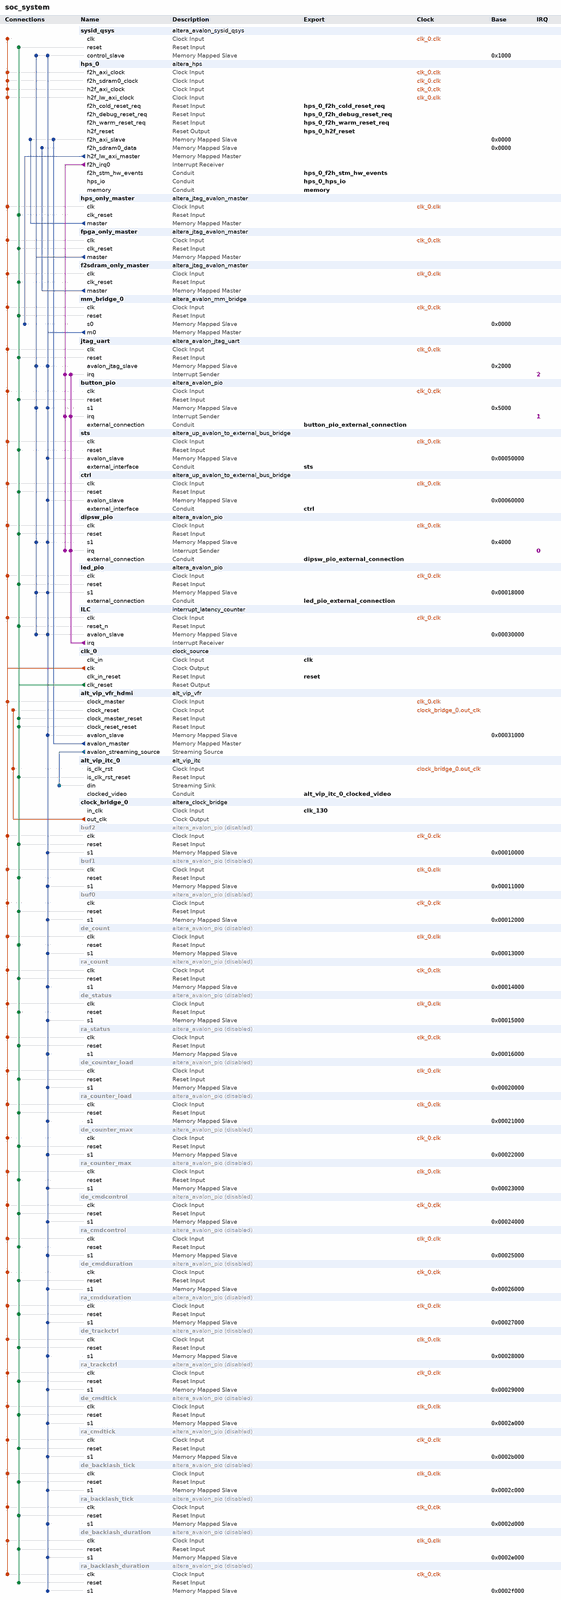
[diagram p0: system contents, whole]
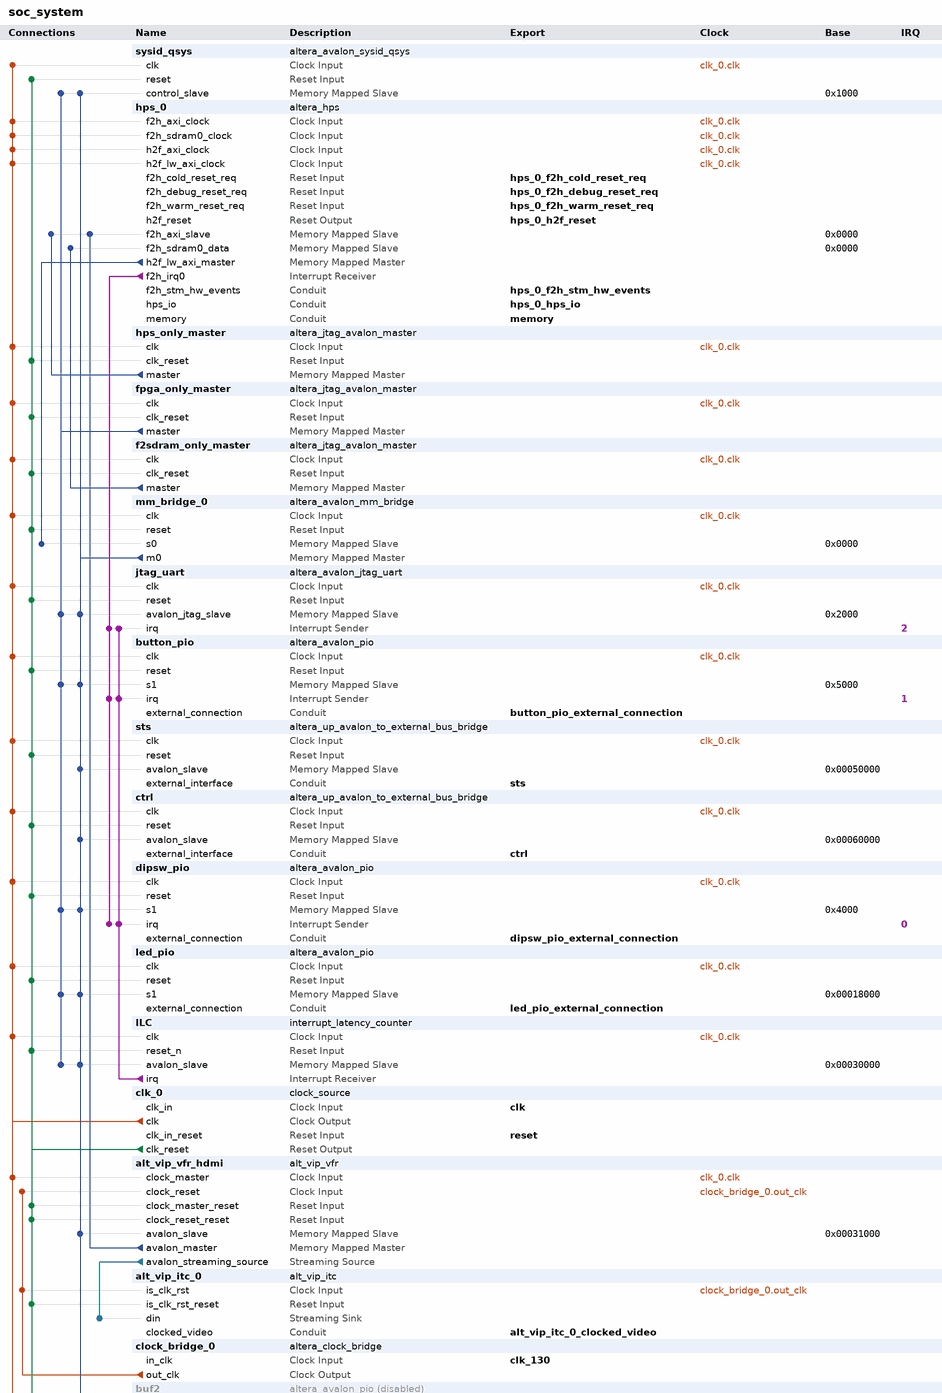
[diagram p1: system contents, upper part]
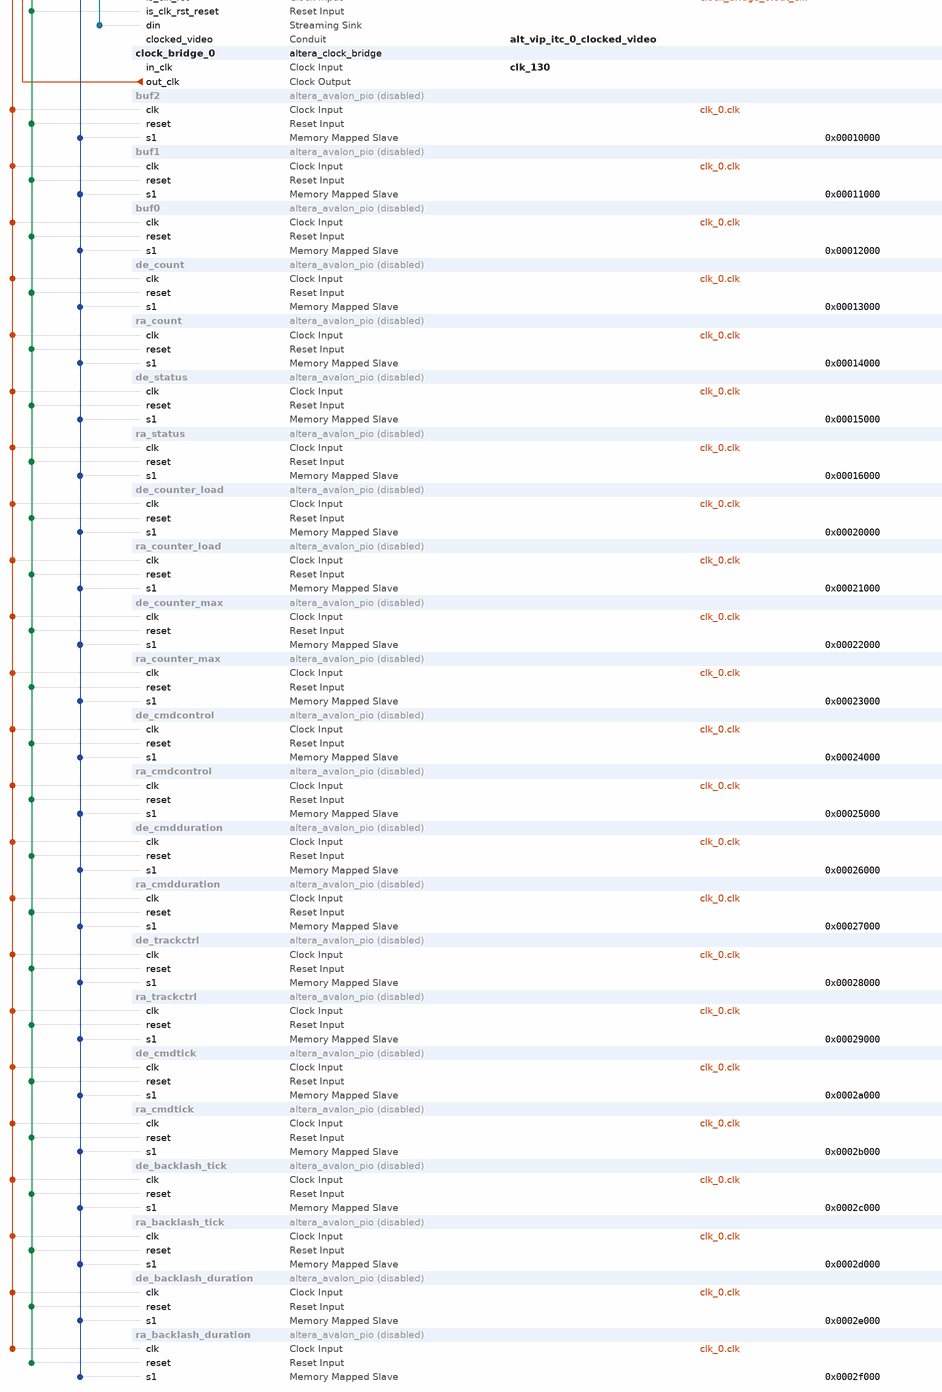
[diagram p2: system contents, lower part]
# Platform Designer (Qsys) system soc_system, Cyclone V 5CSEBA6U23I7DK
# Parameters at their usual value, and those the tool derives, are not listed.
package require -exact qsys 18.1
create_system soc_system
set_project_property DEVICE_FAMILY {Cyclone V}
set_project_property DEVICE 5CSEBA6U23I7DK

add_instance sysid_qsys altera_avalon_sysid_qsys 18.1
set_instance_parameter_value sysid_qsys id -1395322110

add_instance hps_0 altera_hps 18.1
set_instance_parameter_value hps_0 EMAC1_Mode RGMII
set_instance_parameter_value hps_0 EMAC1_PinMuxing {HPS I/O Set 0}
set_instance_parameter_value hps_0 F2SCLK_COLDRST_Enable true
set_instance_parameter_value hps_0 F2SCLK_DBGRST_Enable true
set_instance_parameter_value hps_0 F2SCLK_WARMRST_Enable true
set_instance_parameter_value hps_0 F2SDRAM_Type {Avalon-MM Bidirectional}
set_instance_parameter_value hps_0 F2SDRAM_Width 256
set_instance_parameter_value hps_0 F2SINTERRUPT_Enable true
set_instance_parameter_value hps_0 F2S_Width 3
set_instance_parameter_value hps_0 FPGA_PERIPHERAL_OUTPUT_CLOCK_FREQ_EMAC0_GTX_CLK 100
set_instance_parameter_value hps_0 FPGA_PERIPHERAL_OUTPUT_CLOCK_FREQ_EMAC0_MD_CLK 100.0
set_instance_parameter_value hps_0 FPGA_PERIPHERAL_OUTPUT_CLOCK_FREQ_EMAC1_GTX_CLK 100
set_instance_parameter_value hps_0 FPGA_PERIPHERAL_OUTPUT_CLOCK_FREQ_EMAC1_MD_CLK 100.0
set_instance_parameter_value hps_0 HPS_PROTOCOL DDR3
set_instance_parameter_value hps_0 I2C0_Mode I2C
set_instance_parameter_value hps_0 I2C0_PinMuxing {HPS I/O Set 0}
set_instance_parameter_value hps_0 I2C1_Mode I2C
set_instance_parameter_value hps_0 I2C1_PinMuxing {HPS I/O Set 0}
set_instance_parameter_value hps_0 LWH2F_Enable true
set_instance_parameter_value hps_0 MEM_BANKADDR_WIDTH 3
set_instance_parameter_value hps_0 MEM_CLK_FREQ 400.0
set_instance_parameter_value hps_0 MEM_COL_ADDR_WIDTH 10
set_instance_parameter_value hps_0 MEM_DQ_WIDTH 32
set_instance_parameter_value hps_0 MEM_DRV_STR RZQ/6
set_instance_parameter_value hps_0 MEM_ROW_ADDR_WIDTH 15
set_instance_parameter_value hps_0 MEM_RTT_NOM RZQ/6
set_instance_parameter_value hps_0 MEM_RTT_WR {Dynamic ODT off}
set_instance_parameter_value hps_0 MEM_TCL 7
set_instance_parameter_value hps_0 MEM_TFAW_NS 37.5
set_instance_parameter_value hps_0 MEM_TRAS_NS 35.0
set_instance_parameter_value hps_0 MEM_TRCD_NS 13.75
set_instance_parameter_value hps_0 MEM_TRFC_NS 300.0
set_instance_parameter_value hps_0 MEM_TRP_NS 13.75
set_instance_parameter_value hps_0 MEM_VENDOR Other
set_instance_parameter_value hps_0 MEM_WTCL 7
set_instance_parameter_value hps_0 QSPI_Mode N/A
set_instance_parameter_value hps_0 QSPI_PinMuxing Unused
set_instance_parameter_value hps_0 REF_CLK_FREQ 25.0
set_instance_parameter_value hps_0 S2FCLK_USER2CLK 4
set_instance_parameter_value hps_0 S2F_Width 2
set_instance_parameter_value hps_0 SDIO_Mode {4-bit Data}
set_instance_parameter_value hps_0 SDIO_PinMuxing {HPS I/O Set 0}
set_instance_parameter_value hps_0 SPIM1_Mode {Single Slave Select}
set_instance_parameter_value hps_0 SPIM1_PinMuxing {HPS I/O Set 0}
set_instance_parameter_value hps_0 STM_Enable true
set_instance_parameter_value hps_0 TIMING_BOARD_AC_SKEW 0.02
set_instance_parameter_value hps_0 TIMING_BOARD_AC_TO_CK_SKEW 0.0
set_instance_parameter_value hps_0 TIMING_BOARD_DQ_TO_DQS_SKEW 0.0
set_instance_parameter_value hps_0 TIMING_BOARD_MAX_CK_DELAY 0.6
set_instance_parameter_value hps_0 TIMING_BOARD_MAX_DQS_DELAY 0.6
set_instance_parameter_value hps_0 TIMING_BOARD_SKEW_BETWEEN_DQS 0.02
set_instance_parameter_value hps_0 TIMING_BOARD_SKEW_CKDQS_DIMM_MAX 0.01
set_instance_parameter_value hps_0 TIMING_BOARD_SKEW_CKDQS_DIMM_MIN -0.01
set_instance_parameter_value hps_0 TIMING_BOARD_SKEW_WITHIN_DQS 0.02
set_instance_parameter_value hps_0 TIMING_TDH 125
set_instance_parameter_value hps_0 TIMING_TDQSCK 400
set_instance_parameter_value hps_0 TIMING_TDQSQ 120
set_instance_parameter_value hps_0 TIMING_TDS 50
set_instance_parameter_value hps_0 TIMING_TIH 250
set_instance_parameter_value hps_0 TIMING_TIS 175
set_instance_parameter_value hps_0 TIMING_TQSH 0.38
set_instance_parameter_value hps_0 UART0_Mode {No Flow Control}
set_instance_parameter_value hps_0 UART0_PinMuxing {HPS I/O Set 0}
set_instance_parameter_value hps_0 USB1_Mode SDR
set_instance_parameter_value hps_0 USB1_PinMuxing {HPS I/O Set 0}
set_instance_parameter_value hps_0 desired_cfg_clk_mhz 100.0
set_instance_parameter_value hps_0 desired_qspi_clk_mhz 370.0

add_instance hps_only_master altera_jtag_avalon_master 18.1

add_instance fpga_only_master altera_jtag_avalon_master 18.1

add_instance f2sdram_only_master altera_jtag_avalon_master 18.1

add_instance mm_bridge_0 altera_avalon_mm_bridge 18.1
set_instance_parameter_value mm_bridge_0 ADDRESS_UNITS SYMBOLS
set_instance_parameter_value mm_bridge_0 ADDRESS_WIDTH 10
set_instance_parameter_value mm_bridge_0 DATA_WIDTH 32
set_instance_parameter_value mm_bridge_0 MAX_PENDING_RESPONSES 4
set_instance_parameter_value mm_bridge_0 USE_AUTO_ADDRESS_WIDTH 1

add_instance jtag_uart altera_avalon_jtag_uart 18.1
set_instance_parameter_value jtag_uart allowMultipleConnections true
set_instance_parameter_value jtag_uart simInteractiveOptions INTERACTIVE_ASCII_OUTPUT

add_instance button_pio altera_avalon_pio 18.1
set_instance_parameter_value button_pio bitClearingEdgeCapReg true
set_instance_parameter_value button_pio captureEdge true
set_instance_parameter_value button_pio direction Input
set_instance_parameter_value button_pio edgeType FALLING
set_instance_parameter_value button_pio generateIRQ true
set_instance_parameter_value button_pio irqType EDGE
set_instance_parameter_value button_pio width 2

add_instance sts altera_up_avalon_to_external_bus_bridge 18.0
set_instance_parameter_value sts addr_size 1
set_instance_parameter_value sts addr_size_multiplier Kbytes
set_instance_parameter_value sts data_size 32

add_instance ctrl altera_up_avalon_to_external_bus_bridge 18.0
set_instance_parameter_value ctrl addr_size 1
set_instance_parameter_value ctrl addr_size_multiplier Kbytes
set_instance_parameter_value ctrl data_size 32

add_instance dipsw_pio altera_avalon_pio 18.1
set_instance_parameter_value dipsw_pio bitClearingEdgeCapReg true
set_instance_parameter_value dipsw_pio captureEdge true
set_instance_parameter_value dipsw_pio direction Input
set_instance_parameter_value dipsw_pio edgeType ANY
set_instance_parameter_value dipsw_pio generateIRQ true
set_instance_parameter_value dipsw_pio irqType EDGE
set_instance_parameter_value dipsw_pio width 4

add_instance led_pio altera_avalon_pio 18.1
set_instance_parameter_value led_pio direction Output
set_instance_parameter_value led_pio resetValue 127
set_instance_parameter_value led_pio width 7

add_instance ILC interrupt_latency_counter 18.1

add_instance clk_0 clock_source 18.1
set_instance_parameter_value clk_0 clockFrequency 50000000

add_instance alt_vip_vfr_hdmi alt_vip_vfr 14.0
set_instance_parameter_value alt_vip_vfr_hdmi MAX_IMAGE_WIDTH 1024

add_instance alt_vip_itc_0 alt_vip_itc 14.0
set_instance_parameter_value alt_vip_itc_0 FIFO_DEPTH 1920
set_instance_parameter_value alt_vip_itc_0 H_ACTIVE_PIXELS 1024
set_instance_parameter_value alt_vip_itc_0 H_BACK_PORCH 160
set_instance_parameter_value alt_vip_itc_0 H_FRONT_PORCH 24
set_instance_parameter_value alt_vip_itc_0 H_SYNC_LENGTH 136
set_instance_parameter_value alt_vip_itc_0 NUMBER_OF_COLOUR_PLANES 4
set_instance_parameter_value alt_vip_itc_0 THRESHOLD 1919
set_instance_parameter_value alt_vip_itc_0 V_ACTIVE_LINES 768
set_instance_parameter_value alt_vip_itc_0 V_BACK_PORCH 29
set_instance_parameter_value alt_vip_itc_0 V_FRONT_PORCH 3
set_instance_parameter_value alt_vip_itc_0 V_SYNC_LENGTH 6

add_instance clock_bridge_0 altera_clock_bridge 18.1
set_instance_parameter_value clock_bridge_0 DERIVED_CLOCK_RATE 0
set_instance_parameter_value clock_bridge_0 EXPLICIT_CLOCK_RATE 0

add_instance buf2 altera_avalon_pio 18.1
set_instance_property buf2 ENABLED false
set_instance_parameter_value buf2 bitClearingEdgeCapReg true
set_instance_parameter_value buf2 captureEdge true
set_instance_parameter_value buf2 direction Input
set_instance_parameter_value buf2 edgeType FALLING
set_instance_parameter_value buf2 generateIRQ true
set_instance_parameter_value buf2 irqType EDGE
set_instance_parameter_value buf2 width 32

add_instance buf1 altera_avalon_pio 18.1
set_instance_property buf1 ENABLED false
set_instance_parameter_value buf1 bitClearingEdgeCapReg true
set_instance_parameter_value buf1 captureEdge true
set_instance_parameter_value buf1 direction Input
set_instance_parameter_value buf1 edgeType FALLING
set_instance_parameter_value buf1 generateIRQ true
set_instance_parameter_value buf1 irqType EDGE
set_instance_parameter_value buf1 width 32

add_instance buf0 altera_avalon_pio 18.1
set_instance_property buf0 ENABLED false
set_instance_parameter_value buf0 bitClearingEdgeCapReg true
set_instance_parameter_value buf0 captureEdge true
set_instance_parameter_value buf0 direction Input
set_instance_parameter_value buf0 edgeType FALLING
set_instance_parameter_value buf0 generateIRQ true
set_instance_parameter_value buf0 irqType EDGE
set_instance_parameter_value buf0 width 32

add_instance de_count altera_avalon_pio 18.1
set_instance_property de_count ENABLED false
set_instance_parameter_value de_count bitClearingEdgeCapReg true
set_instance_parameter_value de_count captureEdge true
set_instance_parameter_value de_count direction Input
set_instance_parameter_value de_count edgeType FALLING
set_instance_parameter_value de_count generateIRQ true
set_instance_parameter_value de_count irqType EDGE
set_instance_parameter_value de_count width 32

add_instance ra_count altera_avalon_pio 18.1
set_instance_property ra_count ENABLED false
set_instance_parameter_value ra_count bitClearingEdgeCapReg true
set_instance_parameter_value ra_count captureEdge true
set_instance_parameter_value ra_count direction Input
set_instance_parameter_value ra_count edgeType FALLING
set_instance_parameter_value ra_count generateIRQ true
set_instance_parameter_value ra_count irqType EDGE
set_instance_parameter_value ra_count width 32

add_instance de_status altera_avalon_pio 18.1
set_instance_property de_status ENABLED false
set_instance_parameter_value de_status bitClearingEdgeCapReg true
set_instance_parameter_value de_status captureEdge true
set_instance_parameter_value de_status direction Input
set_instance_parameter_value de_status edgeType FALLING
set_instance_parameter_value de_status generateIRQ true
set_instance_parameter_value de_status irqType EDGE
set_instance_parameter_value de_status width 32

add_instance ra_status altera_avalon_pio 18.1
set_instance_property ra_status ENABLED false
set_instance_parameter_value ra_status bitClearingEdgeCapReg true
set_instance_parameter_value ra_status captureEdge true
set_instance_parameter_value ra_status direction Input
set_instance_parameter_value ra_status edgeType FALLING
set_instance_parameter_value ra_status generateIRQ true
set_instance_parameter_value ra_status irqType EDGE
set_instance_parameter_value ra_status width 32

add_instance de_counter_load altera_avalon_pio 18.1
set_instance_property de_counter_load ENABLED false
set_instance_parameter_value de_counter_load bitClearingEdgeCapReg true
set_instance_parameter_value de_counter_load captureEdge true
set_instance_parameter_value de_counter_load direction Output
set_instance_parameter_value de_counter_load edgeType FALLING
set_instance_parameter_value de_counter_load generateIRQ true
set_instance_parameter_value de_counter_load irqType EDGE
set_instance_parameter_value de_counter_load width 32

add_instance ra_counter_load altera_avalon_pio 18.1
set_instance_property ra_counter_load ENABLED false
set_instance_parameter_value ra_counter_load bitClearingEdgeCapReg true
set_instance_parameter_value ra_counter_load captureEdge true
set_instance_parameter_value ra_counter_load direction Output
set_instance_parameter_value ra_counter_load edgeType FALLING
set_instance_parameter_value ra_counter_load generateIRQ true
set_instance_parameter_value ra_counter_load irqType EDGE
set_instance_parameter_value ra_counter_load width 32

add_instance de_counter_max altera_avalon_pio 18.1
set_instance_property de_counter_max ENABLED false
set_instance_parameter_value de_counter_max bitClearingEdgeCapReg true
set_instance_parameter_value de_counter_max captureEdge true
set_instance_parameter_value de_counter_max direction Output
set_instance_parameter_value de_counter_max edgeType FALLING
set_instance_parameter_value de_counter_max generateIRQ true
set_instance_parameter_value de_counter_max irqType EDGE
set_instance_parameter_value de_counter_max width 32

add_instance ra_counter_max altera_avalon_pio 18.1
set_instance_property ra_counter_max ENABLED false
set_instance_parameter_value ra_counter_max bitClearingEdgeCapReg true
set_instance_parameter_value ra_counter_max captureEdge true
set_instance_parameter_value ra_counter_max direction Output
set_instance_parameter_value ra_counter_max edgeType FALLING
set_instance_parameter_value ra_counter_max generateIRQ true
set_instance_parameter_value ra_counter_max irqType EDGE
set_instance_parameter_value ra_counter_max width 32

add_instance de_cmdcontrol altera_avalon_pio 18.1
set_instance_property de_cmdcontrol ENABLED false
set_instance_parameter_value de_cmdcontrol bitClearingEdgeCapReg true
set_instance_parameter_value de_cmdcontrol captureEdge true
set_instance_parameter_value de_cmdcontrol direction Output
set_instance_parameter_value de_cmdcontrol edgeType FALLING
set_instance_parameter_value de_cmdcontrol generateIRQ true
set_instance_parameter_value de_cmdcontrol irqType EDGE
set_instance_parameter_value de_cmdcontrol width 32

add_instance ra_cmdcontrol altera_avalon_pio 18.1
set_instance_property ra_cmdcontrol ENABLED false
set_instance_parameter_value ra_cmdcontrol bitClearingEdgeCapReg true
set_instance_parameter_value ra_cmdcontrol captureEdge true
set_instance_parameter_value ra_cmdcontrol direction Output
set_instance_parameter_value ra_cmdcontrol edgeType FALLING
set_instance_parameter_value ra_cmdcontrol generateIRQ true
set_instance_parameter_value ra_cmdcontrol irqType EDGE
set_instance_parameter_value ra_cmdcontrol width 32

add_instance de_cmdduration altera_avalon_pio 18.1
set_instance_property de_cmdduration ENABLED false
set_instance_parameter_value de_cmdduration bitClearingEdgeCapReg true
set_instance_parameter_value de_cmdduration captureEdge true
set_instance_parameter_value de_cmdduration direction Output
set_instance_parameter_value de_cmdduration edgeType FALLING
set_instance_parameter_value de_cmdduration generateIRQ true
set_instance_parameter_value de_cmdduration irqType EDGE
set_instance_parameter_value de_cmdduration width 32

add_instance ra_cmdduration altera_avalon_pio 18.1
set_instance_property ra_cmdduration ENABLED false
set_instance_parameter_value ra_cmdduration bitClearingEdgeCapReg true
set_instance_parameter_value ra_cmdduration captureEdge true
set_instance_parameter_value ra_cmdduration direction Output
set_instance_parameter_value ra_cmdduration edgeType FALLING
set_instance_parameter_value ra_cmdduration generateIRQ true
set_instance_parameter_value ra_cmdduration irqType EDGE
set_instance_parameter_value ra_cmdduration width 32

add_instance de_trackctrl altera_avalon_pio 18.1
set_instance_property de_trackctrl ENABLED false
set_instance_parameter_value de_trackctrl bitClearingEdgeCapReg true
set_instance_parameter_value de_trackctrl captureEdge true
set_instance_parameter_value de_trackctrl direction Output
set_instance_parameter_value de_trackctrl edgeType FALLING
set_instance_parameter_value de_trackctrl generateIRQ true
set_instance_parameter_value de_trackctrl irqType EDGE
set_instance_parameter_value de_trackctrl width 32

add_instance ra_trackctrl altera_avalon_pio 18.1
set_instance_property ra_trackctrl ENABLED false
set_instance_parameter_value ra_trackctrl bitClearingEdgeCapReg true
set_instance_parameter_value ra_trackctrl captureEdge true
set_instance_parameter_value ra_trackctrl direction Output
set_instance_parameter_value ra_trackctrl edgeType FALLING
set_instance_parameter_value ra_trackctrl generateIRQ true
set_instance_parameter_value ra_trackctrl irqType EDGE
set_instance_parameter_value ra_trackctrl width 32

add_instance de_cmdtick altera_avalon_pio 18.1
set_instance_property de_cmdtick ENABLED false
set_instance_parameter_value de_cmdtick bitClearingEdgeCapReg true
set_instance_parameter_value de_cmdtick captureEdge true
set_instance_parameter_value de_cmdtick direction Output
set_instance_parameter_value de_cmdtick edgeType FALLING
set_instance_parameter_value de_cmdtick generateIRQ true
set_instance_parameter_value de_cmdtick irqType EDGE
set_instance_parameter_value de_cmdtick width 32

add_instance ra_cmdtick altera_avalon_pio 18.1
set_instance_property ra_cmdtick ENABLED false
set_instance_parameter_value ra_cmdtick bitClearingEdgeCapReg true
set_instance_parameter_value ra_cmdtick captureEdge true
set_instance_parameter_value ra_cmdtick direction Output
set_instance_parameter_value ra_cmdtick edgeType FALLING
set_instance_parameter_value ra_cmdtick generateIRQ true
set_instance_parameter_value ra_cmdtick irqType EDGE
set_instance_parameter_value ra_cmdtick width 32

add_instance de_backlash_tick altera_avalon_pio 18.1
set_instance_property de_backlash_tick ENABLED false
set_instance_parameter_value de_backlash_tick bitClearingEdgeCapReg true
set_instance_parameter_value de_backlash_tick captureEdge true
set_instance_parameter_value de_backlash_tick direction Output
set_instance_parameter_value de_backlash_tick edgeType FALLING
set_instance_parameter_value de_backlash_tick generateIRQ true
set_instance_parameter_value de_backlash_tick irqType EDGE
set_instance_parameter_value de_backlash_tick width 32

add_instance ra_backlash_tick altera_avalon_pio 18.1
set_instance_property ra_backlash_tick ENABLED false
set_instance_parameter_value ra_backlash_tick bitClearingEdgeCapReg true
set_instance_parameter_value ra_backlash_tick captureEdge true
set_instance_parameter_value ra_backlash_tick direction Output
set_instance_parameter_value ra_backlash_tick edgeType FALLING
set_instance_parameter_value ra_backlash_tick generateIRQ true
set_instance_parameter_value ra_backlash_tick irqType EDGE
set_instance_parameter_value ra_backlash_tick width 32

add_instance de_backlash_duration altera_avalon_pio 18.1
set_instance_property de_backlash_duration ENABLED false
set_instance_parameter_value de_backlash_duration bitClearingEdgeCapReg true
set_instance_parameter_value de_backlash_duration captureEdge true
set_instance_parameter_value de_backlash_duration direction Output
set_instance_parameter_value de_backlash_duration edgeType FALLING
set_instance_parameter_value de_backlash_duration generateIRQ true
set_instance_parameter_value de_backlash_duration irqType EDGE
set_instance_parameter_value de_backlash_duration width 32

add_instance ra_backlash_duration altera_avalon_pio 18.1
set_instance_property ra_backlash_duration ENABLED false
set_instance_parameter_value ra_backlash_duration bitClearingEdgeCapReg true
set_instance_parameter_value ra_backlash_duration captureEdge true
set_instance_parameter_value ra_backlash_duration direction Output
set_instance_parameter_value ra_backlash_duration edgeType FALLING
set_instance_parameter_value ra_backlash_duration generateIRQ true
set_instance_parameter_value ra_backlash_duration irqType EDGE
set_instance_parameter_value ra_backlash_duration width 32

# connections
add_connection clk_0.clk alt_vip_vfr_hdmi.clock_master clock
add_connection clk_0.clk buf0.clk clock
add_connection clk_0.clk buf1.clk clock
add_connection clk_0.clk buf2.clk clock
add_connection clk_0.clk button_pio.clk clock
add_connection clk_0.clk ctrl.clk clock
add_connection clk_0.clk de_backlash_duration.clk clock
add_connection clk_0.clk de_backlash_tick.clk clock
add_connection clk_0.clk de_cmdcontrol.clk clock
add_connection clk_0.clk de_cmdduration.clk clock
add_connection clk_0.clk de_cmdtick.clk clock
add_connection clk_0.clk de_count.clk clock
add_connection clk_0.clk de_counter_load.clk clock
add_connection clk_0.clk de_counter_max.clk clock
add_connection clk_0.clk de_status.clk clock
add_connection clk_0.clk de_trackctrl.clk clock
add_connection clk_0.clk dipsw_pio.clk clock
add_connection clk_0.clk f2sdram_only_master.clk clock
add_connection clk_0.clk fpga_only_master.clk clock
add_connection clk_0.clk hps_0.f2h_axi_clock clock
add_connection clk_0.clk hps_0.f2h_sdram0_clock clock
add_connection clk_0.clk hps_0.h2f_axi_clock clock
add_connection clk_0.clk hps_0.h2f_lw_axi_clock clock
add_connection clk_0.clk hps_only_master.clk clock
add_connection clk_0.clk ILC.clk clock
add_connection clk_0.clk jtag_uart.clk clock
add_connection clk_0.clk led_pio.clk clock
add_connection clk_0.clk mm_bridge_0.clk clock
add_connection clk_0.clk ra_backlash_duration.clk clock
add_connection clk_0.clk ra_backlash_tick.clk clock
add_connection clk_0.clk ra_cmdcontrol.clk clock
add_connection clk_0.clk ra_cmdduration.clk clock
add_connection clk_0.clk ra_cmdtick.clk clock
add_connection clk_0.clk ra_count.clk clock
add_connection clk_0.clk ra_counter_load.clk clock
add_connection clk_0.clk ra_counter_max.clk clock
add_connection clk_0.clk ra_status.clk clock
add_connection clk_0.clk ra_trackctrl.clk clock
add_connection clk_0.clk sts.clk clock
add_connection clk_0.clk sysid_qsys.clk clock
add_connection clock_bridge_0.out_clk alt_vip_itc_0.is_clk_rst clock
add_connection clock_bridge_0.out_clk alt_vip_vfr_hdmi.clock_reset clock
add_connection clk_0.clk_reset alt_vip_itc_0.is_clk_rst_reset reset
add_connection clk_0.clk_reset alt_vip_vfr_hdmi.clock_master_reset reset
add_connection clk_0.clk_reset alt_vip_vfr_hdmi.clock_reset_reset reset
add_connection clk_0.clk_reset buf0.reset reset
add_connection clk_0.clk_reset buf1.reset reset
add_connection clk_0.clk_reset buf2.reset reset
add_connection clk_0.clk_reset button_pio.reset reset
add_connection clk_0.clk_reset ctrl.reset reset
add_connection clk_0.clk_reset de_backlash_duration.reset reset
add_connection clk_0.clk_reset de_backlash_tick.reset reset
add_connection clk_0.clk_reset de_cmdcontrol.reset reset
add_connection clk_0.clk_reset de_cmdduration.reset reset
add_connection clk_0.clk_reset de_cmdtick.reset reset
add_connection clk_0.clk_reset de_count.reset reset
add_connection clk_0.clk_reset de_counter_load.reset reset
add_connection clk_0.clk_reset de_counter_max.reset reset
add_connection clk_0.clk_reset de_status.reset reset
add_connection clk_0.clk_reset de_trackctrl.reset reset
add_connection clk_0.clk_reset dipsw_pio.reset reset
add_connection clk_0.clk_reset f2sdram_only_master.clk_reset reset
add_connection clk_0.clk_reset fpga_only_master.clk_reset reset
add_connection clk_0.clk_reset hps_only_master.clk_reset reset
add_connection clk_0.clk_reset ILC.reset_n reset
add_connection clk_0.clk_reset jtag_uart.reset reset
add_connection clk_0.clk_reset led_pio.reset reset
add_connection clk_0.clk_reset mm_bridge_0.reset reset
add_connection clk_0.clk_reset ra_backlash_duration.reset reset
add_connection clk_0.clk_reset ra_backlash_tick.reset reset
add_connection clk_0.clk_reset ra_cmdcontrol.reset reset
add_connection clk_0.clk_reset ra_cmdduration.reset reset
add_connection clk_0.clk_reset ra_cmdtick.reset reset
add_connection clk_0.clk_reset ra_count.reset reset
add_connection clk_0.clk_reset ra_counter_load.reset reset
add_connection clk_0.clk_reset ra_counter_max.reset reset
add_connection clk_0.clk_reset ra_status.reset reset
add_connection clk_0.clk_reset ra_trackctrl.reset reset
add_connection clk_0.clk_reset sts.reset reset
add_connection clk_0.clk_reset sysid_qsys.reset reset
add_connection alt_vip_vfr_hdmi.avalon_master hps_0.f2h_axi_slave avalon
set_connection_parameter_value alt_vip_vfr_hdmi.avalon_master/hps_0.f2h_axi_slave baseAddress 0x0000
add_connection f2sdram_only_master.master hps_0.f2h_sdram0_data avalon
set_connection_parameter_value f2sdram_only_master.master/hps_0.f2h_sdram0_data baseAddress 0x0000
add_connection fpga_only_master.master button_pio.s1 avalon
set_connection_parameter_value fpga_only_master.master/button_pio.s1 baseAddress 0x5000
add_connection fpga_only_master.master dipsw_pio.s1 avalon
set_connection_parameter_value fpga_only_master.master/dipsw_pio.s1 baseAddress 0x4000
add_connection fpga_only_master.master ILC.avalon_slave avalon
set_connection_parameter_value fpga_only_master.master/ILC.avalon_slave baseAddress 0x00030000
add_connection fpga_only_master.master jtag_uart.avalon_jtag_slave avalon
set_connection_parameter_value fpga_only_master.master/jtag_uart.avalon_jtag_slave baseAddress 0x2000
add_connection fpga_only_master.master led_pio.s1 avalon
set_connection_parameter_value fpga_only_master.master/led_pio.s1 baseAddress 0x00018000
add_connection fpga_only_master.master sysid_qsys.control_slave avalon
set_connection_parameter_value fpga_only_master.master/sysid_qsys.control_slave baseAddress 0x1000
add_connection hps_0.h2f_lw_axi_master mm_bridge_0.s0 avalon
set_connection_parameter_value hps_0.h2f_lw_axi_master/mm_bridge_0.s0 baseAddress 0x0000
add_connection hps_only_master.master hps_0.f2h_axi_slave avalon
set_connection_parameter_value hps_only_master.master/hps_0.f2h_axi_slave baseAddress 0x0000
add_connection mm_bridge_0.m0 alt_vip_vfr_hdmi.avalon_slave avalon
set_connection_parameter_value mm_bridge_0.m0/alt_vip_vfr_hdmi.avalon_slave baseAddress 0x00031000
add_connection mm_bridge_0.m0 buf0.s1 avalon
set_connection_parameter_value mm_bridge_0.m0/buf0.s1 baseAddress 0x00012000
add_connection mm_bridge_0.m0 buf1.s1 avalon
set_connection_parameter_value mm_bridge_0.m0/buf1.s1 baseAddress 0x00011000
add_connection mm_bridge_0.m0 buf2.s1 avalon
set_connection_parameter_value mm_bridge_0.m0/buf2.s1 baseAddress 0x00010000
add_connection mm_bridge_0.m0 button_pio.s1 avalon
set_connection_parameter_value mm_bridge_0.m0/button_pio.s1 baseAddress 0x5000
add_connection mm_bridge_0.m0 ctrl.avalon_slave avalon
set_connection_parameter_value mm_bridge_0.m0/ctrl.avalon_slave baseAddress 0x00060000
add_connection mm_bridge_0.m0 de_backlash_duration.s1 avalon
set_connection_parameter_value mm_bridge_0.m0/de_backlash_duration.s1 baseAddress 0x0002e000
add_connection mm_bridge_0.m0 de_backlash_tick.s1 avalon
set_connection_parameter_value mm_bridge_0.m0/de_backlash_tick.s1 baseAddress 0x0002c000
add_connection mm_bridge_0.m0 de_cmdcontrol.s1 avalon
set_connection_parameter_value mm_bridge_0.m0/de_cmdcontrol.s1 baseAddress 0x00024000
add_connection mm_bridge_0.m0 de_cmdduration.s1 avalon
set_connection_parameter_value mm_bridge_0.m0/de_cmdduration.s1 baseAddress 0x00026000
add_connection mm_bridge_0.m0 de_cmdtick.s1 avalon
set_connection_parameter_value mm_bridge_0.m0/de_cmdtick.s1 baseAddress 0x0002a000
add_connection mm_bridge_0.m0 de_count.s1 avalon
set_connection_parameter_value mm_bridge_0.m0/de_count.s1 baseAddress 0x00013000
add_connection mm_bridge_0.m0 de_counter_load.s1 avalon
set_connection_parameter_value mm_bridge_0.m0/de_counter_load.s1 baseAddress 0x00020000
add_connection mm_bridge_0.m0 de_counter_max.s1 avalon
set_connection_parameter_value mm_bridge_0.m0/de_counter_max.s1 baseAddress 0x00022000
add_connection mm_bridge_0.m0 de_status.s1 avalon
set_connection_parameter_value mm_bridge_0.m0/de_status.s1 baseAddress 0x00015000
add_connection mm_bridge_0.m0 de_trackctrl.s1 avalon
set_connection_parameter_value mm_bridge_0.m0/de_trackctrl.s1 baseAddress 0x00028000
add_connection mm_bridge_0.m0 dipsw_pio.s1 avalon
set_connection_parameter_value mm_bridge_0.m0/dipsw_pio.s1 baseAddress 0x4000
add_connection mm_bridge_0.m0 ILC.avalon_slave avalon
set_connection_parameter_value mm_bridge_0.m0/ILC.avalon_slave baseAddress 0x00030000
add_connection mm_bridge_0.m0 jtag_uart.avalon_jtag_slave avalon
set_connection_parameter_value mm_bridge_0.m0/jtag_uart.avalon_jtag_slave baseAddress 0x2000
add_connection mm_bridge_0.m0 led_pio.s1 avalon
set_connection_parameter_value mm_bridge_0.m0/led_pio.s1 baseAddress 0x00018000
add_connection mm_bridge_0.m0 ra_backlash_duration.s1 avalon
set_connection_parameter_value mm_bridge_0.m0/ra_backlash_duration.s1 baseAddress 0x0002f000
add_connection mm_bridge_0.m0 ra_backlash_tick.s1 avalon
set_connection_parameter_value mm_bridge_0.m0/ra_backlash_tick.s1 baseAddress 0x0002d000
add_connection mm_bridge_0.m0 ra_cmdcontrol.s1 avalon
set_connection_parameter_value mm_bridge_0.m0/ra_cmdcontrol.s1 baseAddress 0x00025000
add_connection mm_bridge_0.m0 ra_cmdduration.s1 avalon
set_connection_parameter_value mm_bridge_0.m0/ra_cmdduration.s1 baseAddress 0x00027000
add_connection mm_bridge_0.m0 ra_cmdtick.s1 avalon
set_connection_parameter_value mm_bridge_0.m0/ra_cmdtick.s1 baseAddress 0x0002b000
add_connection mm_bridge_0.m0 ra_count.s1 avalon
set_connection_parameter_value mm_bridge_0.m0/ra_count.s1 baseAddress 0x00014000
add_connection mm_bridge_0.m0 ra_counter_load.s1 avalon
set_connection_parameter_value mm_bridge_0.m0/ra_counter_load.s1 baseAddress 0x00021000
add_connection mm_bridge_0.m0 ra_counter_max.s1 avalon
set_connection_parameter_value mm_bridge_0.m0/ra_counter_max.s1 baseAddress 0x00023000
add_connection mm_bridge_0.m0 ra_status.s1 avalon
set_connection_parameter_value mm_bridge_0.m0/ra_status.s1 baseAddress 0x00016000
add_connection mm_bridge_0.m0 ra_trackctrl.s1 avalon
set_connection_parameter_value mm_bridge_0.m0/ra_trackctrl.s1 baseAddress 0x00029000
add_connection mm_bridge_0.m0 sts.avalon_slave avalon
set_connection_parameter_value mm_bridge_0.m0/sts.avalon_slave baseAddress 0x00050000
add_connection mm_bridge_0.m0 sysid_qsys.control_slave avalon
set_connection_parameter_value mm_bridge_0.m0/sysid_qsys.control_slave baseAddress 0x1000
add_connection alt_vip_vfr_hdmi.avalon_streaming_source alt_vip_itc_0.din avalon_streaming
add_connection hps_0.f2h_irq0 button_pio.irq interrupt
set_connection_parameter_value hps_0.f2h_irq0/button_pio.irq irqNumber 1
add_connection hps_0.f2h_irq0 dipsw_pio.irq interrupt
set_connection_parameter_value hps_0.f2h_irq0/dipsw_pio.irq irqNumber 0
add_connection hps_0.f2h_irq0 jtag_uart.irq interrupt
set_connection_parameter_value hps_0.f2h_irq0/jtag_uart.irq irqNumber 2
add_connection ILC.irq button_pio.irq interrupt
set_connection_parameter_value ILC.irq/button_pio.irq irqNumber 1
add_connection ILC.irq dipsw_pio.irq interrupt
set_connection_parameter_value ILC.irq/dipsw_pio.irq irqNumber 0
add_connection ILC.irq jtag_uart.irq interrupt
set_connection_parameter_value ILC.irq/jtag_uart.irq irqNumber 2

# exported interfaces
add_interface alt_vip_itc_0_clocked_video conduit end
set_interface_property alt_vip_itc_0_clocked_video EXPORT_OF alt_vip_itc_0.clocked_video
add_interface button_pio_external_connection conduit end
set_interface_property button_pio_external_connection EXPORT_OF button_pio.external_connection
add_interface clk clock sink
set_interface_property clk EXPORT_OF clk_0.clk_in
add_interface clk_130 clock sink
set_interface_property clk_130 EXPORT_OF clock_bridge_0.in_clk
add_interface ctrl conduit end
set_interface_property ctrl EXPORT_OF ctrl.external_interface
add_interface dipsw_pio_external_connection conduit end
set_interface_property dipsw_pio_external_connection EXPORT_OF dipsw_pio.external_connection
add_interface hps_0_f2h_cold_reset_req reset sink
set_interface_property hps_0_f2h_cold_reset_req EXPORT_OF hps_0.f2h_cold_reset_req
add_interface hps_0_f2h_debug_reset_req reset sink
set_interface_property hps_0_f2h_debug_reset_req EXPORT_OF hps_0.f2h_debug_reset_req
add_interface hps_0_f2h_stm_hw_events conduit end
set_interface_property hps_0_f2h_stm_hw_events EXPORT_OF hps_0.f2h_stm_hw_events
add_interface hps_0_f2h_warm_reset_req reset sink
set_interface_property hps_0_f2h_warm_reset_req EXPORT_OF hps_0.f2h_warm_reset_req
add_interface hps_0_h2f_reset reset source
set_interface_property hps_0_h2f_reset EXPORT_OF hps_0.h2f_reset
add_interface hps_0_hps_io conduit end
set_interface_property hps_0_hps_io EXPORT_OF hps_0.hps_io
add_interface led_pio_external_connection conduit end
set_interface_property led_pio_external_connection EXPORT_OF led_pio.external_connection
add_interface memory conduit end
set_interface_property memory EXPORT_OF hps_0.memory
add_interface reset reset sink
set_interface_property reset EXPORT_OF clk_0.clk_in_reset
add_interface sts conduit end
set_interface_property sts EXPORT_OF sts.external_interface

set_interconnect_requirement {$system} qsys_mm.clockCrossingAdapter HANDSHAKE
set_interconnect_requirement {$system} qsys_mm.maxAdditionalLatency 1

save_system soc_system.qsys
